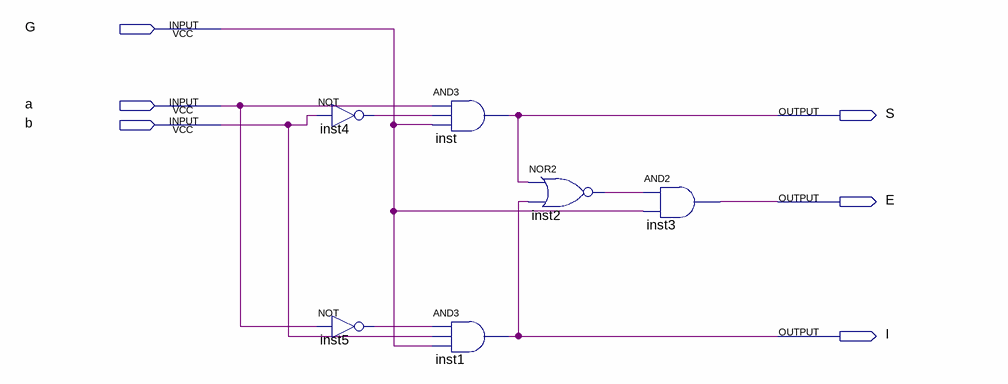
[diagram p0: schematic sheet]
// Quartus schematic ss21bit.bdf as structural Verilog: 6 symbols, 6 pins
module ss21bit (
  input  G,
  input  a,
  input  b,
  output S,
  output E,
  output I
);

  wire inst2_out, inst4_out, inst5_out;

  not inst4 (inst4_out, b);
  not inst5 (inst5_out, a);
  and inst (S, a, inst4_out, G);
  and inst1 (I, inst5_out, b, G);
  nor inst2 (inst2_out, S, I);
  and inst3 (E, inst2_out, G);
endmodule
